# EAGLE design tb_project_ir_blaster_wemos_revA (EAGLE 7.6.0)
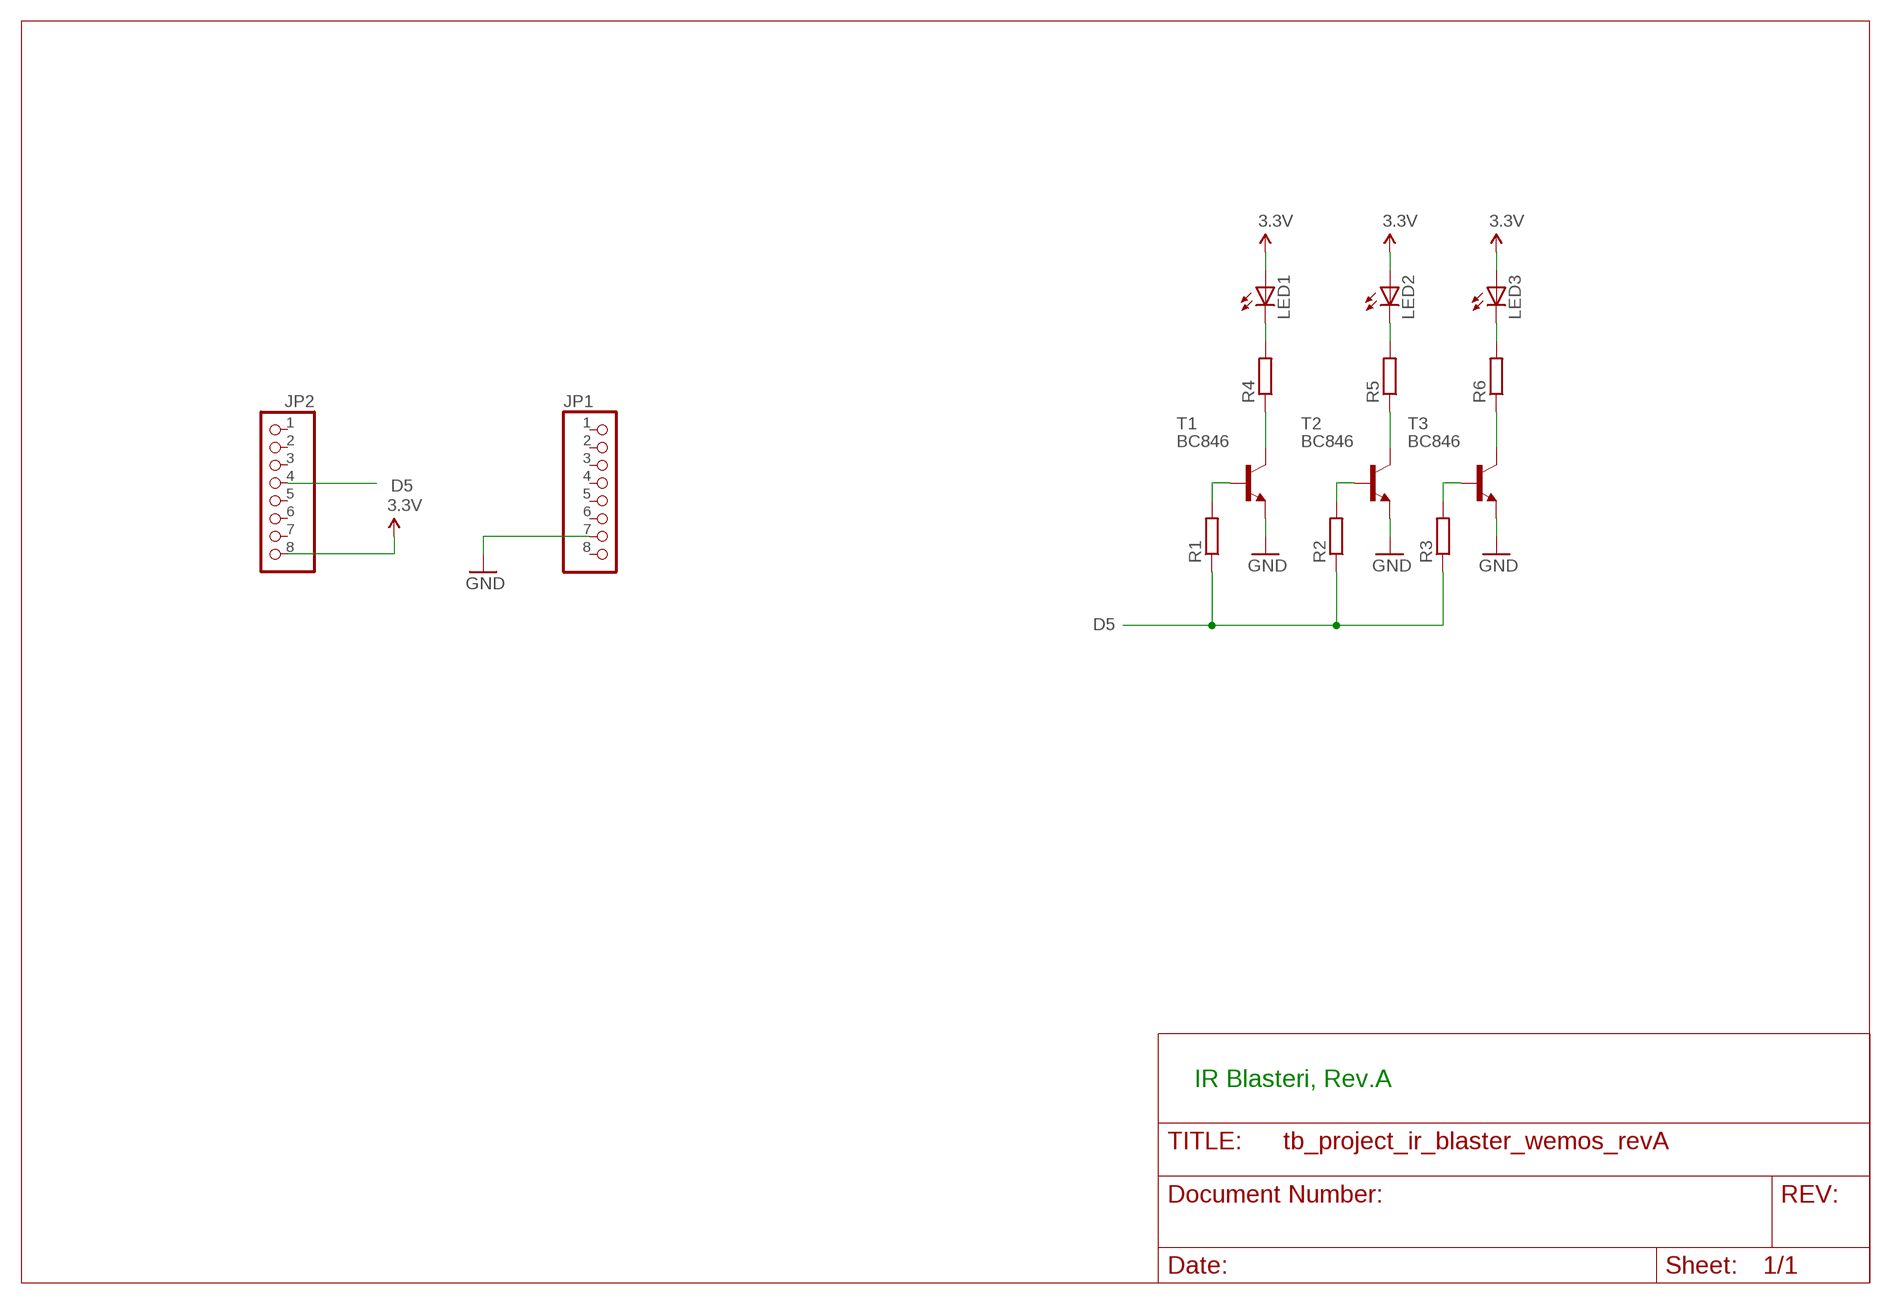
[diagram p0: schematic, sheet 1]

## Parts
JP1  PINHD-1X8  [1X08]
JP2  PINHD-1X8  [1X08]
LED1  LED5MM  [LED5MM]
LED2  LED5MM  [LED5MM]
LED3  LED5MM  [LED5MM]
R1  R-EU_R1206  [R1206]
R2  R-EU_R1206  [R1206]
R3  R-EU_R1206  [R1206]
R4  R-EU_R1206  [R1206]
R5  R-EU_R1206  [R1206]
R6  R-EU_R1206  [R1206]
T1  BC846  [SOT23]
T2  BC846  [SOT23]
T3  BC846  [SOT23]

## Nets
3.3V: JP2.8 LED1.A LED2.A LED3.A
D5: JP2.4 R1.1 R2.1 R3.1
GND: JP1.7 T1.2(E) T2.2(E) T3.2(E)
N$2: LED1.K(C) R4.2
N$3: LED2.K(C) R5.2
N$4: LED3.K(C) R6.2
N$5: R4.1 T1.3(C)
N$6: R5.1 T2.3(C)
N$7: R6.1 T3.3(C)
N$8: R1.2 T1.1(B)
N$9: R2.2 T2.1(B)
N$10: R3.2 T3.1(B)
Unconnected: JP1.1 JP1.2 JP1.3 JP1.4 JP1.5 JP1.6 JP1.8 JP2.1 JP2.2 JP2.3 JP2.5 JP2.6 JP2.7

## Notes on the sheet
- IR Blasteri, Rev.A

## Library data of the parts
JP1 JP2 = pinhead:PINHD-1X8: PIN HEADER
LED1-LED3 = led:LED: LED OSRAM: - CHIPLED LG R971, LG N971, LY N971, LG Q971, LY Q971, LO R971, LY R971 LH N974, LH R974 LS Q976, LO Q976, LY Q976 LO Q996 - Hyper CHIPLED LW Q18S LB Q993, LB Q99A, LB R99A - SideLED LS A670, LO A670, LY A670, LG A670, LP A670 LB A673, LV A673, LT A673, LW A673 LH A674 LY A675 LS A676, LA A676, LO A676, LY A676, LW A676 LS A679, LY A679, LG A679 - Hyper Micro SIDELED® LS Y876, LA Y876, LO Y876, LY Y876 LT Y87S - SmartLED LW L88C, LW L88S LB L89C, LB L89S, LG L890 LS L89K, LO L89K, LY L89K LS L896, LA L896, LO L896, LY L896 - TOPLED LS T670, LO T670, LY T670, LG T670, LP T670 LSG T670, LSP T670, LSY T670, LOP T670, LYG T670 LG T671, LOG T671, LSG T671 LB T673, LV T673, LT T673, LW T673 LH T674 LS T676, LA T676, LO T676, LY T676, LB T676, LH T676, LSB T676, LW T676 LB T67C, LV T67C, LT T67C, LS T67K, LO T67K, LY T67K, LW E67C LS E67B, LA E67B, LO E67B, LY E67B, LB E67C, LV E67C, LT E67C LW T67C LS T679, LY T679, LG T679 LS T770, LO T770, LY T770, LG T770, LP T770 LB T773, LV T773, LT T773, LW T773 LH T774 LS E675, LA E675, LY E675, LS T675 LS T776, LA T776, LO T776, LY T776, LB T776 LHGB T686 LT T68C, LB T68C - Hyper Mini TOPLED® LB M676 - Mini TOPLED Santana® LG M470 LS M47K, LO M47K, LY M47K Source: http://www.osram.convergy.de LUXEON: - LUMILED® LXK2-PW12-R00, LXK2-PW12-S00, LXK2-PW14-U00, LXK2-PW14-V00 LXK2-PM12-R00, LXK2-PM12-S00, LXK2-PM14-U00 LXK2-PE12-Q00, LXK2-PE12-R00, LXK2-PE12-S00, LXK2-PE14-T00, LXK2-PE14-U00 LXK2-PB12-K00, LXK2-PB12-L00, LXK2-PB12-M00, LXK2-PB14-N00, LXK2-PB14-P00, LXK2-PB14-Q00 LXK2-PR12-L00, LXK2-PR12-M00, LXK2-PR14-Q00, LXK2-PR14-R00 LXK2-PD12-Q00, LXK2-PD12-R00, LXK2-PD12-S00 LXK2-PH12-R00, LXK2-PH12-S00 LXK2-PL12-P00, LXK2-PL12-Q00, LXK2-PL12-R00 Source: www.luxeon.com KINGBRIGHT: KA-3528ASYC Source: www.kingbright.com
R1-R6 = resistor:R-EU_: RESISTOR, European symbol
T1-T3 = transistor-neu-to92:BC846: NPN TRANSISTOR

## Net classes
0 default: width 0.203 mm, drill 0.356 mm, clearance 0.152 mm

## Board
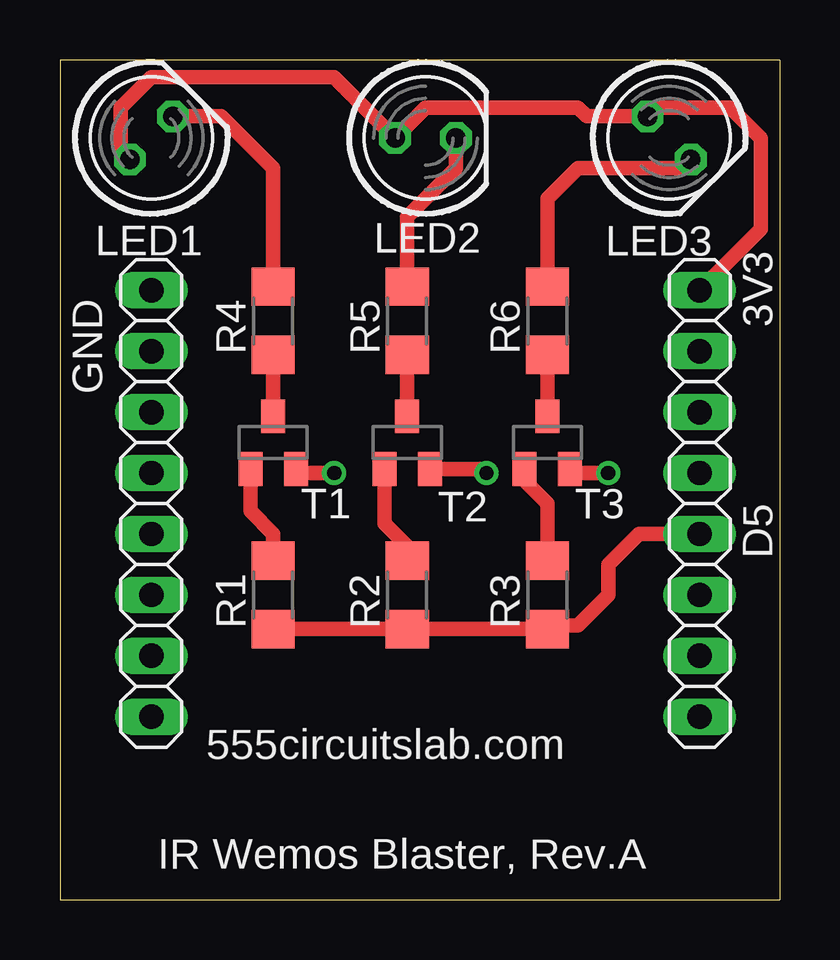
[diagram p1: board, top side]
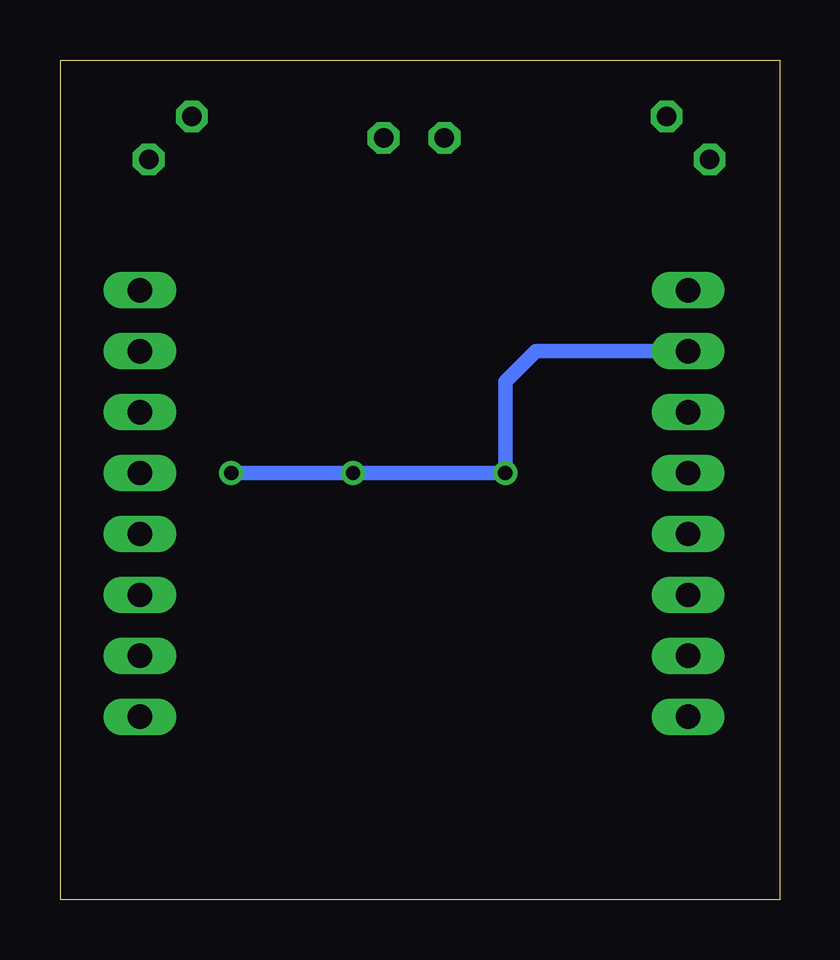
[diagram p2: board, bottom side, seen from below]

Size 30 x 35 mm. Coordinates in mm from the lower left corner, seen from the top.
Outline: 0,0 30,0 30,35 0,35 0,0
Copper layers (1*16): Top 0.035mm / dielectric 1.5mm / Bottom 0.035mm
Design rules "default": minimum track width 10mil, minimum drill 24mil, track to track 8mil, track to pad 8mil, pad to pad 8mil, via to via 8mil, smd to smd 8mil, copper to edge 40mil, drill to drill 8mil, minimum pad ring 10mil, minimum via ring 8mil, stop-mask expansion 4mil, vias tented up to drill 0mil, thermal gap 10mil

### Footprints (pad centres in the part's own frame; a part is rotated, then mirrored left to right if it is on the bottom)
1X08 = drill 1.016 long: 1 -8.89,0; 2 -6.35,0; 3 -3.81,0; 4 -1.27,0; 5 1.27,0; 6 3.81,0; 7 6.35,0; 8 8.89,0
LED5MM = drill 0.813 octagon: A -1.27,0; K 1.27,0
R1206 = smd 1.6 x 1.803: 1 -1.422,0; 2 1.422,0
SOT23 = smd 1 x 1.4: 1 -0.95,-1.1; 2 0.95,-1.1; 3 0,1.1

### Placement (x,y rotation side)
JP1  3.81,16.51 90 top
JP2  26.67,16.51 90 top
LED1  3.81,31.75 45 top
LED2  15.24,31.75 0 top
LED3  25.4,31.75 315 top
R1  8.89,12.7 90 top
R2  14.48,12.7 90 top
R3  20.32,12.7 90 top
R4  8.89,24.13 90 top
R5  14.48,24.13 90 top
R6  20.32,24.13 90 top
T1  8.89,19.05 0 top
T2  14.48,19.05 0 top
T3  20.32,19.05 0 top

### Tracks (layer width: path | path; a pad name or v marks a point on that pad's centre or on a via)
3.3V
  Top 0.61: LED1.A 2.54,31.22 2.54,33.02 3.81,34.29 11.43,34.29 LED2.A 15.24,33.02 21.59,33.02 21.96,32.65 LED3.A 24.87,33.02 27.94,33.02 29.21,31.75 29.21,27.94 JP2.8
D5
  Top 0.61: R1.1 R2.1 R3.1 20.47,11.43 21.59,11.43 22.86,12.7 22.86,13.97 24.13,15.24 JP2.4
GND  (via drill 0.6)
  Top 0.61: v11.43,17.78 10.01,17.78 T1.2 | T2.2 17.61,17.95 v17.78,17.78 | v22.86,17.78 21.44,17.78 T3.2
  Bottom 0.61: JP1.7 10.16,22.86 11.43,21.59 v11.43,17.78 v17.78,17.78 v22.86,17.78
N$2
  Top 0.61: R4.2 8.89,30.48 6.72,32.65 LED1.K
N$3
  Top 0.61: LED2.K 16.51,30.48 14.48,28.45 R5.2
N$4
  Top 0.61: R6.2 20.32,29.21 21.59,30.48 25.93,30.48 LED3.K
N$5
  Top 0.61: T1.3 R4.1
N$6
  Top 0.61: R5.1 T2.3
N$7
  Top 0.61: R6.1 T3.3
N$8
  Top 0.61: T1.1 7.94,16.19 8.89,15.24 R1.2
N$9
  Top 0.61: R2.2 14.48,14.73 13.53,15.68 T2.1
N$10
  Top 0.61: T3.1 19.37,17.46 20.32,16.51 R3.2

### Text on the board
tPlace: 3V3 | GND | D5 | 555circuitslab.com | IR Wemos Blaster, Rev.A